# EAGLE design PaintDuino (EAGLE 6.2)
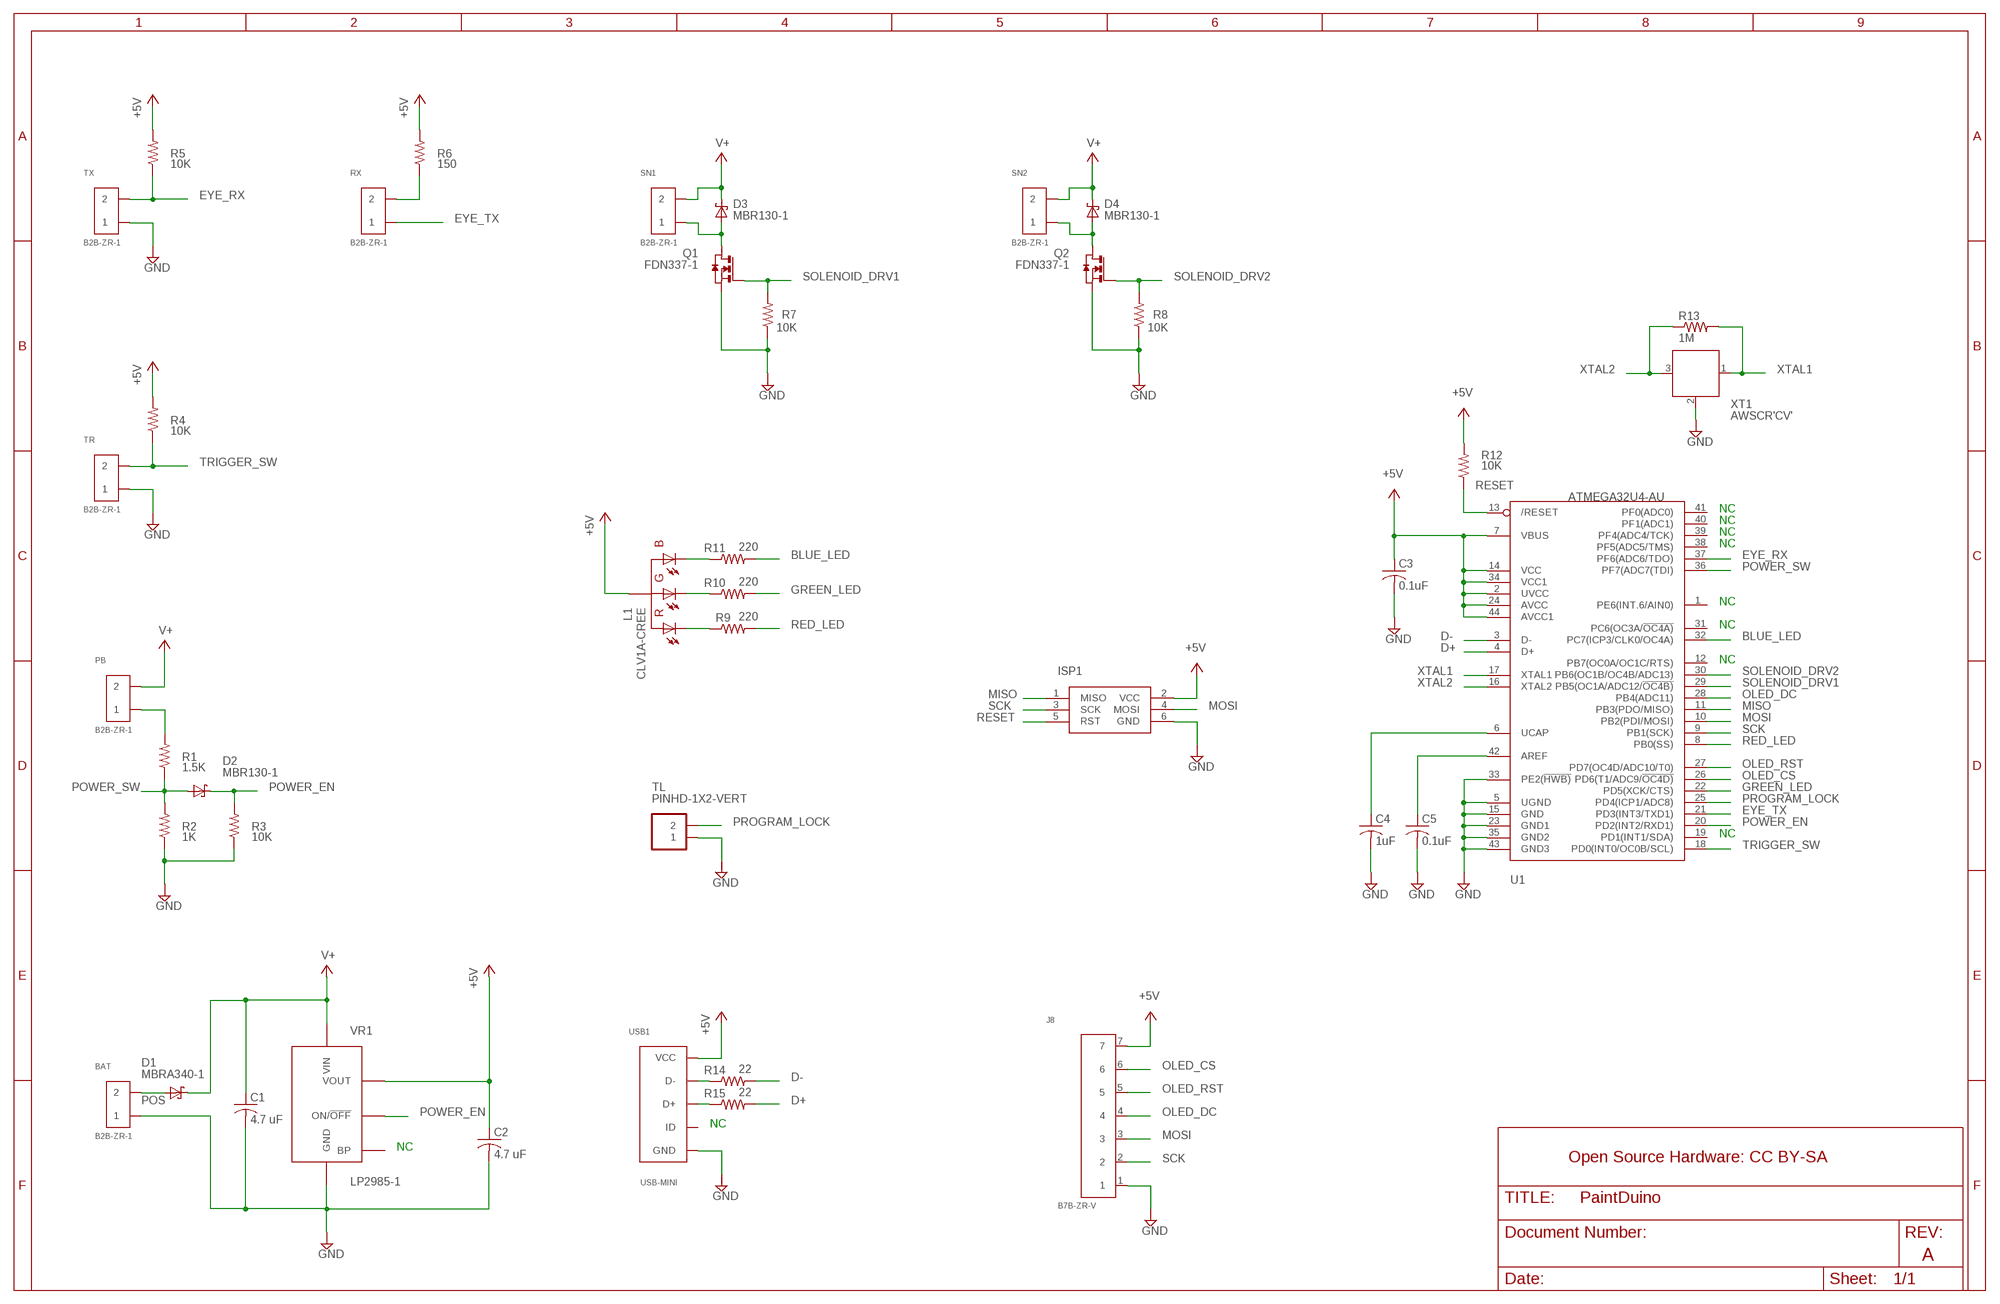
[diagram p0: schematic, sheet 1]

## Parts
BAT  B2B-ZR-1  [B2B-ZR]
C1  4.7 uF  CAP-0805  [C0805]
C2  4.7 uF  CAP-0805  [C0805]
C3  0.1uF  CAP-0805  [C0805]
C4  1uF  CAP-0805  [C0805]
C5  0.1uF  CAP-0805  [C0805]
D1  MBRA340-1  [DO214AC]
D2  MBR130-1  [SOD123]
D3  MBR130-1  [SOD123]
D4  MBR130-1  [SOD123]
ISP1  AVRISP-6  [AVRISP]
J8  B7B-ZR-V  [B7B-ZR]
L1  CLV1A-CREE  [PLCC4]
PB  B2B-ZR-1  [B2B-ZR]
Q1  FDN337-1  FDN359-1  [SOT23]
Q2  FDN337-1  FDN359-1  [SOT23]
R1  1.5K  RES-2  [R0805]
R2  1K  RES-2  [R0805]
R3  10K  RES-2  [R0805]
R4  10K  RES-2  [R0805]
R5  10K  RES-2  [R0805]
R6  150  RES-2  [R0805]
R7  10K  RES-2  [R0805]
R8  10K  RES-2  [R0805]
R9  220  RES-2  [R0805]
R10  220  RES-2  [R0805]
R11  220  RES-2  [R0805]
R12  10K  RES-2  [R0805]
R13  1M  RES-2  [R0805]
R14  22  RES-2  [R0805]
R15  22  RES-2  [R0805]
RX  B2B-ZR-1  [B2B-ZR]
SN1  B2B-ZR-1  [B2B-ZR]
SN2  B2B-ZR-1  [B2B-ZR]
TL  PINHD-1X2-VERT  [1X02]
TR  B2B-ZR-1  [B2B-ZR]
TX  B2B-ZR-1  [B2B-ZR]
U1  ATMEGA32U4-AU  [TQFP44]
USB1  USB-MINI  [USB-M2]
VR1  LP2985-1  [SOT23-5]
XT1  AWSCR'CV'  [AWSCR-CV]

## Nets
+5V: C2.1 C3.1 ISP1.2(VCC) J8.7 L1.2-CA(A) R4.2 R5.2 R6.2 R12.2 U1.2(UVCC) U1.7(VBUS) U1.14(VCC) U1.24(AVCC) U1.34(VCC1) U1.44(AVCC1) USB1.1(VCC) VR1.5(VOUT)
AREF: C5.1 U1.42(AREF)
BC: L1.3-B(BC) R11.1
BLUE_LED: R11.2 U1.32(PC7(ICP3/CLK0/OC4A))
D+: R15.2 U1.4(D+)
D-: R14.2 U1.3(D-)
EYE_C: R6.1 RX.2
EYE_RX: R5.1 TX.2 U1.37(PF6(ADC6/TDO))
EYE_TX: RX.1 U1.21(PD3(INT3/TXD1))
GC: L1.4-G(GC) R10.1
GND: BAT.1 C1.2 C2.2 C3.2 C4.2 C5.2 ISP1.6(GND) J8.1 Q1.2(S) Q2.2(S) R2.1 R3.1 R7.1 R8.1 TL.1 TR.1 TX.1 U1.5(UGND) U1.15(GND) U1.23(GND1) U1.33(PE2(!HWB)) U1.35(GND2) U1.43(GND3) USB1.5(GND) VR1.2(GND) XT1.2
GREEN_LED: R10.2 U1.22(PD5(XCK/CTS))
MISO: ISP1.1(MISO) U1.11(PB3(PDO/MISO))
MOSI: ISP1.4(MOSI) J8.3 U1.10(PB2(PDI/MOSI))
N$1: R14.1 USB1.2(D-)
N$2: R15.1 USB1.3(D+)
OLED_CS: J8.6 U1.26(PD6(T1/ADC9/!OC4D))
OLED_DC: J8.4 U1.28(PB4(ADC11))
OLED_RST: J8.5 U1.27(PD7(OC4D/ADC10/T0))
PB: PB.1 R1.2
POS: BAT.2 D1.A
POWER_EN: D2.C R3.2 U1.20(PD2(INT2/RXD1)) VR1.3(ON/!OFF)
POWER_SW: D2.A R1.1 R2.2 U1.36(PF7(ADC7(TDI))
PROGRAM_LOCK: TL.2 U1.25(PD4(ICP1/ADC8))
Q1_D: D3.A Q1.3(D) SN1.1
Q2_D: D4.A Q2.3(D) SN2.1
RC: L1.1-R(RC) R9.1
RED_LED: R9.2 U1.8(PB0(SS))
RESET: ISP1.5(RST) R12.1 U1.13(/RESET)
SCK: ISP1.3(SCK) J8.2 U1.9(PB1(SCK))
SOLENOID_DRV1: Q1.1(G) R7.2 U1.29(PB5(OC1A/ADC12/!OC4B))
SOLENOID_DRV2: Q2.1(G) R8.2 U1.30(PB6(OC1B/OC4B/ADC13))
TRIGGER_SW: R4.1 TR.2 U1.18(PD0(INT0/OC0B/SCL))
UCAP: C4.1 U1.6(UCAP)
V+: C1.1 D1.C D3.C D4.C PB.2 SN1.2 SN2.2 VR1.1(VIN)
XTAL1: R13.2 U1.17(XTAL1) XT1.1
XTAL2: R13.1 U1.16(XTAL2) XT1.3
Unconnected: U1.1(PE6(INT.6/AIN0)) U1.12(PB7(OC0A/OC1C/RTS)) U1.19(PD1(INT1/SDA)) U1.31(PC6(OC3A/!OC4A)) U1.38(PF5(ADC5/TMS)) U1.39(PF4(ADC4/TCK)) U1.40(PF1(ADC1)) U1.41(PF0(ADC0)) USB1.4(ID) VR1.4(BP)

## Notes on the sheet
- NC
- NC
- NC
- NC
- NC
- NC
- NC
- NC
- NC
- NC
- Open Source Hardware: CC BY-SA
- A

## Library data of the parts
BAT PB RX SN1 SN2 TR TX = Moorelogic:B2B-ZR
C1-C5 = Moorelogic:CAP
D1 = Moorelogic:MBRA340
D2-D4 = Moorelogic:MBR130
ISP1 = Moorelogic:AVRISP: AVR ISP HEADER Standard 6 pin header for AVR programming
J8 = Moorelogic:B7B-ZR
L1 = Moorelogic:CLV1A
Q1 Q2 = Moorelogic:FDN359
R1-R15 = Moorelogic:RES
TL = Moorelogic:PINHD-1X2
U1 = Moorelogic:ATMEGA32U4: http://www.ladyada.net/library/eagle
USB1 = Moorelogic:USB
VR1 = Moorelogic:LP2985
XT1 = Moorelogic:AWSCR: ceramic resonator with caps

## Net classes
0 default: width 0.381 mm, clearance 0.203 mm

## Board
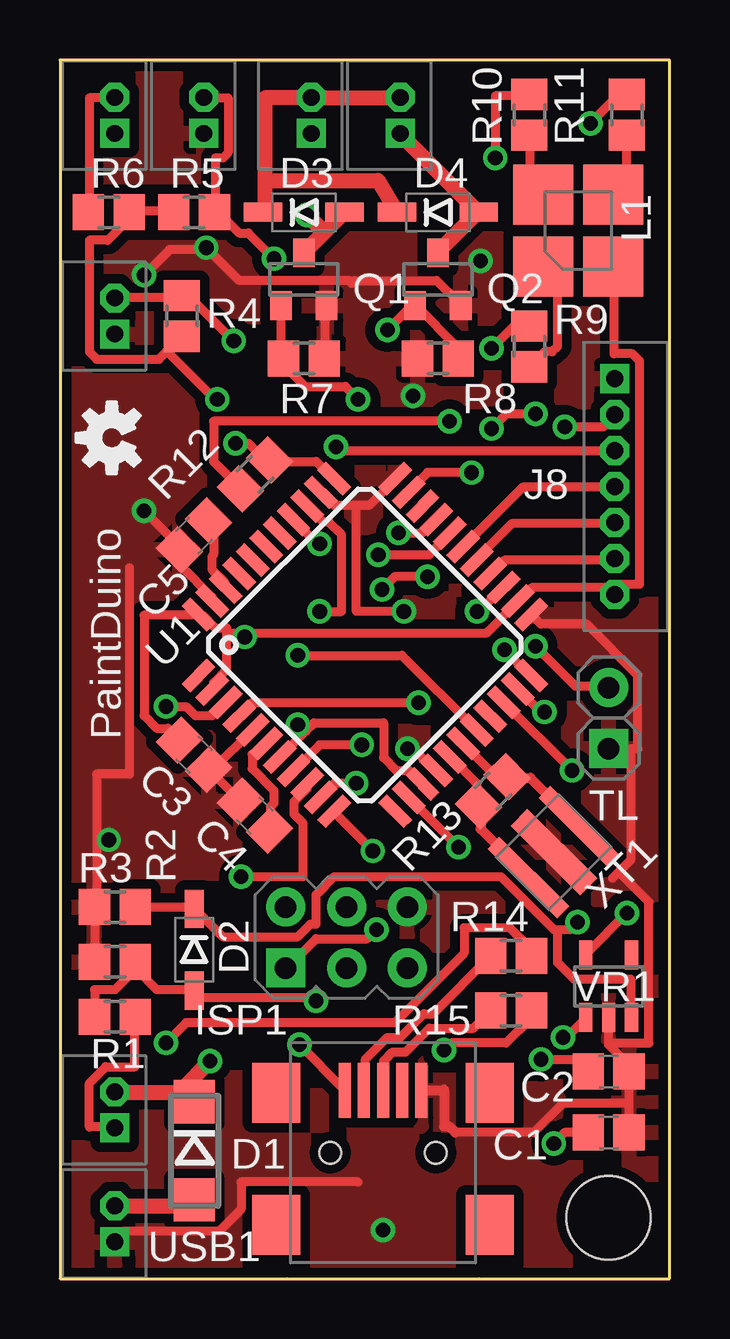
[diagram p1: board, top side]
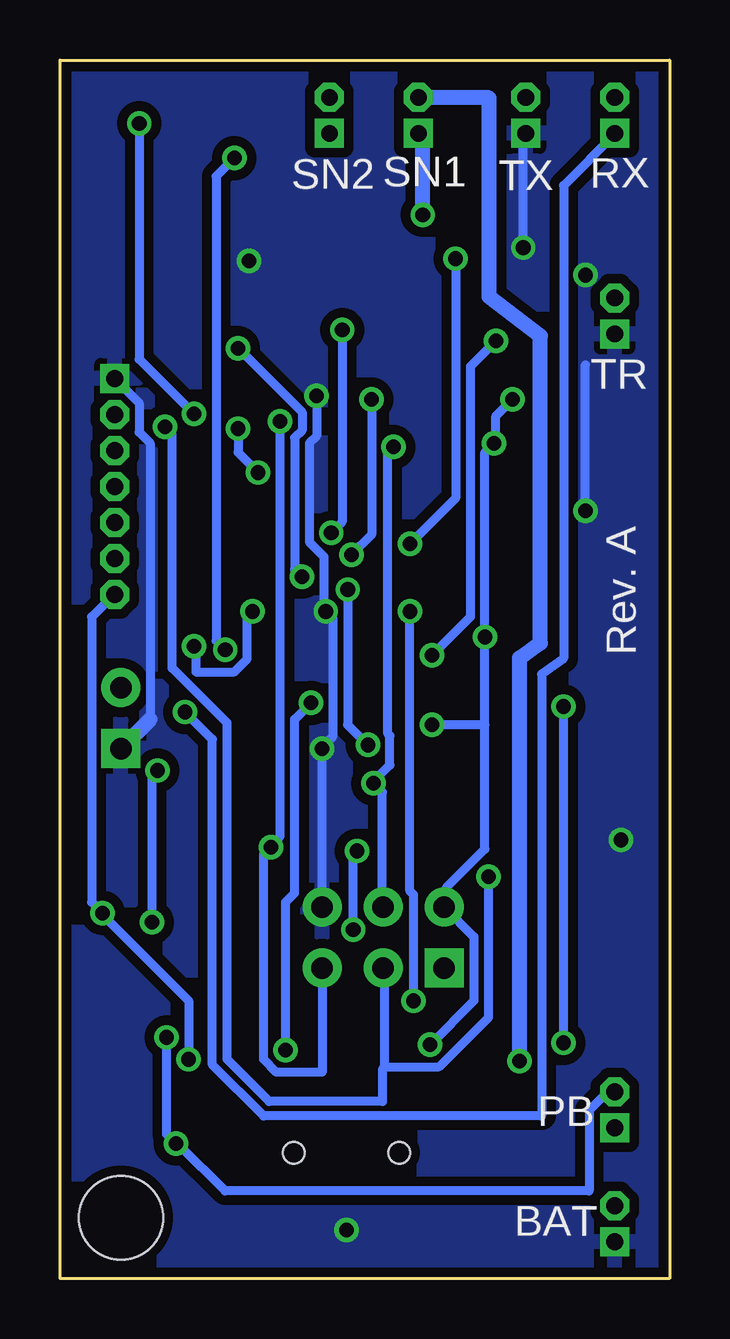
[diagram p2: board, bottom side, seen from below]

Size 25.4 x 50.8 mm. Coordinates in mm from the lower left corner, seen from the top.
Outline: 0,0 25.4,0 25.4,50.8 0,50.8 0,0
Copper layers (1*16): Top 0.035mm / dielectric 1.5mm / Bottom 0.035mm
Design rules: minimum track width 10mil, minimum drill 24mil, track to track 8mil, track to pad 8mil, pad to pad 8mil, via to via 8mil, smd to smd 8mil, copper to edge 15mil, drill to drill 8mil, minimum pad ring 10mil, minimum via ring 8mil, stop-mask expansion 4mil, vias tented up to drill 0mil, thermal gap 10mil
Holes 3.5 mm at 22.86,2.54

### Footprints (pad centres in the part's own frame; a part is rotated, then mirrored left to right if it is on the bottom)
B2B-ZR = drill 0.7 square: 1 -0.75,0 | drill 0.7 octagon: 2 0.75,0
C0805 = smd 1.3 x 1.5: 1 -0.85,0; 2 0.85,0
DO214AC = smd 1.8 x 1.7: A 2.05,0; C -2.05,0
SOD123 = smd 1.6 x 0.8: A 1.7,0; C -1.7,0
AVRISP = drill 0.9 pad 1.626 square: 1 -1.27,2.54 | drill 0.9 pad 1.626: 2 1.27,2.54; 3 -1.27,0; 4 1.27,0; 5 -1.27,-2.54; 6 1.27,-2.54
B7B-ZR = drill 0.7 square: 1 -4.5,0 | drill 0.7 octagon: 2 -3,0; 3 -1.5,0; 4 0,0; 5 1.5,0; 6 3,0; 7 4.5,0
PLCC4 = smd 2.5 x 2.5: 1-R -1.455,-1.5; 2-CA 1.455,-1.5; 3-B 1.455,1.5; 4-G -1.455,1.5
SOT23 = smd 0.9 x 1.2: 1 -0.95,-1.1; 2 0.95,-1.1; 3 0,1.1
R0805 = smd 1.3 x 1.5: 1 -0.85,0; 2 0.85,0
1X02 = drill 0.9 pad 1.626 square: 1 -1.27,0 | drill 0.9 pad 1.626: 2 1.27,0
TQFP44 = smd 1.5 x 0.5: 1 -5.8,4; 2 -5.8,3.2; 3 -5.8,2.4; 4 -5.8,1.6; 5 -5.8,0.8; 6 -5.8,0; 7 -5.8,-0.8; 8 -5.8,-1.6; 9 -5.8,-2.4; 10 -5.8,-3.2; 11 -5.8,-4; 23 5.8,-4; 24 5.8,-3.2; 25 5.8,-2.4; 26 5.8,-1.6; 27 5.8,-0.8; 28 5.8,0; 29 5.8,0.8; 30 5.8,1.6; 31 5.8,2.4; 32 5.8,3.2; 33 5.8,4 | smd 0.5 x 1.5: 12 -4,-5.8; 13 -3.2,-5.8; 14 -2.4,-5.8; 15 -1.6,-5.8; 16 -0.8,-5.8; 17 0,-5.8; 18 0.8,-5.8; 19 1.6,-5.8; 20 2.4,-5.8; 21 3.2,-5.8; 22 4,-5.8; 34 4,5.8; 35 3.2,5.8; 36 2.4,5.8; 37 1.6,5.8; 38 0.8,5.8; 39 0,5.8; 40 -0.8,5.8; 41 -1.6,5.8; 42 -2.4,5.8; 43 -3.2,5.8; 44 -4,5.8
USB-M2 = smd 0.5 x 2.3: 1 -1.6,2.6; 2 -0.8,2.6; 3 0,2.6; 4 0.8,2.6; 5 1.6,2.6 | smd 2 x 2.5: TAB1 -4.45,2.5; TAB2 -4.45,-3; TAB3 4.45,2.5; TAB4 4.45,-3 | hole 0.9: -2.2,0; 2.2,0
SOT23-5 = smd 0.55 x 1.2: 1 -0.95,-1.3; 2 0,-1.3; 3 0.95,-1.3; 4 0.95,1.3; 5 -0.95,1.3
AWSCR-CV = smd 0.7 x 4.1: 1 -1.5,0; 3 1.5,0 | smd 1 x 4.1: 2 0,0

### Placement (x,y rotation side)
BAT  2.29,2.29 90 top
C1  22.86,6.1 0 top
C2  22.86,8.64 0 top
C3  5.59,21.84 315 top
C4  8.13,19.3 135 top
C5  5.59,30.99 225 top
D1  5.59,5.33 270 top
D2  5.59,13.72 270 top
D3  10.16,44.45 0 top
D4  15.75,44.45 0 top
ISP1  11.94,14.22 90 top
J8  23.11,33.02 270 top
L1  21.59,43.69 0 top
PB  2.29,7.04 90 top
Q1  10.16,41.66 0 top
Q2  15.75,41.66 0 top
R1  2.29,10.92 0 top
R2  2.29,13.21 0 top
R3  2.29,15.49 0 top
R4  5.08,40.13 270 top
R5  5.59,44.45 180 top
R6  2.03,44.45 0 top
R7  10.16,38.35 180 top
R8  15.75,38.35 0 top
R9  19.56,38.86 90 top
R10  19.56,48.51 90 top
R11  23.62,48.51 90 top
R12  8.13,33.53 45 top
R13  18.03,20.32 45 top
R14  18.8,13.46 0 top
R15  18.8,11.18 0 top
RX  2.29,48.49 90 top
SN1  10.46,48.49 90 top
SN2  14.17,48.49 90 top
TL  22.86,23.37 90 top
TR  2.29,40.13 90 top
TX  5.99,48.49 90 top
U1  12.7,26.42 45 top
U$1  [OSHW-LOGO-S]  2.16,35.05 90 top
USB1  13.46,5.26 0 top
VR1  22.86,12.19 0 top
XT1  20.57,17.78 225 top

### Tracks (layer width: path | path; a pad name or v marks a point on that pad's centre or on a via)
+5V  (via drill 0.61)
  Top 0.381: R5.2 4.72,44.5 2.9,44.5 R6.2 3.05,44.35 1.98,43.28 1.22,43.28 1.22,38.63 1.52,38.33 4.12,38.33 4.46,38.67 | 4.46,38.67 5.03,39.24 R4.2 | 10.25,22.82 9.22,21.79 U1.7 | 10.25,22.82 10.59,23.16 13.49,23.16 13.49,21.72 14.02,21.18 14.55,21.18 15.09,20.65 U1.14 | U1.34 11.35,33.38 10.67,34.06 8.76,34.06 R12.2 8.53,34.14 7.85,34.82 v7.32,34.82 | v9.98,9.75 11.81,7.92 USB1.1 | 10.25,22.82 9.98,23.09 v9.91,23.09 | 4.46,38.67 6.48,36.65 v6.55,36.65 | C3.1 4.95,22.48 4.5,22.94 4.04,22.94 3.5,23.47 3.5,27.66 5.71,27.66 U1.44 5.94,27.66 6.48,27.13 6.93,27.13 6.93,26.9 | 6.93,26.9 6.93,25.38 6.4,24.84 6.4,24.61 U1.2 | v23.62,15.24 21.95,13.56 VR1.5 | v20.04,9.14 21.49,9.14 21.95,8.69 C2.1 | L1.2-CA 23.09,42.14 23.09,38.56 23.85,38.56 24.16,38.25 24.16,28.96 22.94,28.96 J8.7 23.09,28.57 22.86,28.8 19.66,28.8 19.13,28.27 U1.24 18.97,28.12 17.75,26.9 7.7,26.9 | 7.7,26.9 6.93,26.9 | v7.7,26.75 7.7,26.9
  Bottom 0.381: v9.98,9.75 8.15,11.58 8.15,14.25 ISP1.2 9.3,15.62 9.3,16.31 7.7,17.91 7.7,23.09 | 7.7,23.09 v7.7,26.75 7.7,34.44 v7.32,34.82 7.24,34.98 7.24,35.97 v6.55,36.65 | 7.7,23.09 v9.91,23.09 | J8.7 23.16,28.5 24.08,27.58 24.08,15.7 v23.62,15.24 23.55,15.09 20.04,11.58 v20.04,9.14
AREF
  Top 0.381: U1.42 6.86,28.88 6.86,29.03 6.33,29.57 6.33,30.1 6.4,30.18 6.4,31.55 6.25,31.55 C5.1
BC
  Top 0.381: R11.1 23.62,45.26 23.09,45.26 L1.3-B
BLUE_LED  (via drill 0.61)
  Top 0.381: v17.14,33.6 15.32,33.6 14.55,32.84 U1.32 | v17.98,35.43 18.59,36.04 v19.81,36.04 | v22.1,48.16 23.24,49.3 23.62,49.3 R11.2
  Bottom 0.381: v17.14,33.6 17.98,34.44 v17.98,35.43 | v19.81,36.04 22.1,38.33 v22.1,48.16
D+  (via drill 0.61)
  Top 0.381: v14.94,24 8,24 7.47,23.47 U1.4 | v16,9.53 16.31,9.83 18.59,9.83 19.58,10.82 19.58,11.12 R15.2
  Bottom 0.381: v14.94,24 15.62,23.32 15.62,16.08 16,15.7 v16,9.53
D-  (via drill 0.61)
  Top 0.381: v4.42,23.85 5.26,23.85 5.64,23.47 6.33,23.47 6.86,24 U1.3 | v4.42,9.83 5.26,10.67 13.95,10.67 16.84,13.56 16.84,14.63 18.75,14.63 19.58,13.79 19.58,13.49 R14.2
  Bottom 0.381: v4.42,9.83 v4.42,23.85
EYE_C
  Top 0.381: R6.1 1.22,44.5 1.22,49.23 2.29,49.23 RX.2
EYE_RX  (via drill 0.61)
  Top 0.381: TX.2 6.02,49.23 7.01,49.23 7.01,46.94 6.78,46.71 6.48,46.71 6.48,44.5 R5.1 6.63,44.42 7.47,43.59 7.85,43.59 v8.91,42.52 | v10.82,30.63 10.74,30.63 9.75,31.62 U1.37
  Bottom 0.381: v10.82,30.63 8.91,32.54 v8.91,42.52
EYE_TX  (via drill 0.61)
  Top 0.381: v20.19,23.62 20.04,23.62 19.13,24.54 U1.21
  Bottom 0.381: v20.19,23.62 19.05,22.48 19.05,8.91 16.92,6.78 5.33,6.78 5.33,25.2 4.42,25.86 4.42,45.57 2.29,47.7 RX.1
GC
  Top 0.381: R10.1 19.58,47.62 19.58,45.26 20.12,45.26 L1.4-G
GND  (via drill 0.61)
  Top 0.381: TL.1 23.77,22.1 | 23.77,22.1 24.08,22.1 24.08,25.15 21.95,27.28 20.04,27.28 19.66,27.66 U1.23 | 21.64,16.69 20.57,17.75 XT1.2 | 23.28,16.95 23.77,17.45 23.77,22.1 | 23.28,16.95 23.01,16.69 | 22.86,9.83 22.86,9.75 23.7,8.91 23.7,8.69 C2.2 23.7,8.46 23.7,7.32 | 22.86,9.83 VR1.2 | 23.7,7.32 23.7,6.1 C1.2 | 16.46,6.1 19.74,6.1 20.95,7.32 23.7,7.32 | 15.09,7.85 USB1.5 | 12.42,4.04 7.54,4.04 7.54,2.9 6.63,1.98 2.67,1.98 2.29,1.6 BAT.1 | 23.28,16.95 24.54,15.7 24.54,9.83 22.86,9.83 | R2.1 1.45,13.26 1.45,15.47 R3.1 1.52,15.62 1.52,21.03 2.9,21.03 2.9,29.64 | C3.2 6.25,21.18 7.47,19.96 C4.2 | U1.5 8,22.86 6.4,21.26 C3.2 | 6.17,21.03 C3.2 | U1.43 6.33,28.27 6.33,28.42 5.03,29.72 5.03,30.33 C5.2 4.95,30.56 v3.5,32 | 12.34,32.23 12.88,32.23 13.95,33.3 U1.33 | 12.34,32.23 11.43,32.23 10.9,32.77 U1.35 | v14.48,22.1 14.71,22.1 15.62,21.18 U1.15 | 12.34,32.23 12.34,27.81 v14.33,27.81 | Q2.2 16.69,40.62 15.7,41.6 12.27,41.6 12.15,41.49 12.04,41.6 7.47,41.6 v6.1,42.98 5.94,42.9 4.57,42.9 v3.5,41.83 | 11.28,40.62 Q1.2 11.05,40.54 11.05,38.41 R7.1 11.2,38.41 | 14.86,38.41 R8.1 | 23.09,37.49 J8.1
  Top 0.406: 15.09,7.85 16,7.85 | 16,7.85 16,7.87 | 16,7.85 16,6.35 16.2,6.35 16.46,6.1
  Bottom 0.381: v3.5,32 3.5,38.1 | 2.29,39.32 TR.1 2.44,39.47 | ISP1.6 v14.48,22.1 14.4,22.25 14.02,22.63 14.02,27.51 v14.33,27.81 14.4,27.96 14.4,30.1 15.01,30.71 15.01,34.82 14.71,35.13 v14.71,36.8 | 6.02,47.7 6.1,47.62 v6.1,42.98 | 21.64,23.32 21.64,34.82 22.1,35.28 22.1,36.5 23.09,37.49 J8.1
  Bottom 0.635: 21.64,23.32 TL.1
  other vias: 2.03,18.29 13.46,2.03 17.53,42.42
  pour Bottom (isolate 0.406): -1.27,52.07 26.67,52.07 26.67,-1.27 -1.27,-1.27
  pour Top (isolate 0.406): -1.27,52.2 26.67,52.2 26.67,-1.27 -1.27,-1.27
GREEN_LED  (via drill 0.61)
  Top 0.381: v18.52,26.21 19.58,25.15 U1.22 | v18.14,46.71 18.14,49.3 19.51,49.3 R10.2
  Bottom 0.381: v18.52,26.21 18.9,26.59 18.9,45.95 v18.14,46.71
MISO  (via drill 0.61)
  Top 0.381: v13.03,17.83 11.43,19.43 U1.11 | v13.18,14.55 12.8,14.17 10.67,14.17 9.45,12.95 ISP1.1
  Bottom 0.381: v13.03,17.83 13.18,17.68 v13.18,14.55
MOSI  (via drill 0.61)
  Top 0.381: v12.34,20.65 11.43,20.65 10.9,20.12 U1.10 | v11.51,34.67 11.66,34.52 23.09,34.52 J8.3
  Bottom 0.381: ISP1.4 11.96,15.54 11.96,20.27 v12.34,20.65 12.27,20.8 11.66,21.41 11.66,22.63 11.73,22.71 11.73,34.44 v11.51,34.67
N$1
  Top 0.381: R14.1 17.91,13.41 15.54,11.05 15.16,11.05 14.17,10.06 13.64,10.06 12.72,9.14 12.72,7.92 USB1.2
N$2
  Top 0.381: R15.1 17.91,11.12 17.22,10.44 15.39,10.44 14.4,9.45 13.87,9.45 13.49,9.07 13.49,7.92 USB1.3
OLED_CS
  Top 0.381: U1.26 17.98,29.41 18.52,29.95 23.09,29.95 J8.6
OLED_DC
  Top 0.381: U1.28 19.28,32.99 23.09,32.99 J8.4
OLED_RST
  Top 0.381: U1.27 17.37,30.02 18.82,31.47 23.09,31.47 J8.5
PB
  Top 0.381: R1.2 3.12,10.9 3.12,8.84 1.91,8.84 1.22,8.15 1.22,6.33 2.29,6.33 PB.1
POS
  Top 0.381: 5.33,3.05 5.56,3.28 D1.A | BAT.2
  Top 0.635: BAT.2 5.33,3.05
POWER_EN  (via drill 0.61)
  Top 0.381: 20.73,14.55 20.73,13.18 21.41,12.5 23.77,12.5 23.77,10.9 VR1.3 | 20.73,14.55 20.57,14.55 18.36,16.76 11.43,16.76 10.67,16 10.67,14.78 10.44,14.78 9.91,14.25 6.78,14.25 5.64,15.39 D2.C 5.41,15.47 3.2,15.47 R3.2 | v21.34,21.18 18.52,24 U1.20 | v21.57,14.86 21.26,14.55 20.73,14.55
  Bottom 0.381: v21.34,21.18 21.57,20.95 v21.57,14.86
POWER_SW  (via drill 0.61)
  Top 0.381: R1.1 1.45,10.97 1.45,12.04 2.29,12.04 3.12,12.88 3.12,13.18 R2.2 3.28,12.8 4.04,12.04 5.41,12.04 D2.A 5.64,11.96 5.87,11.73 10.52,11.73 v10.67,11.58 | v10.82,27.81 11.73,27.81 11.73,31.01 11.2,31.55 10.97,31.55 10.36,32.16 U1.36
  Bottom 0.381: v10.82,27.81 10.82,16.15 10.67,16 v10.67,11.58
PROGRAM_LOCK  (via drill 0.61)
  Top 0.381: v17.37,27.81 17.45,27.81 18.44,28.8 U1.25 | v19.81,26.36 21.49,24.69 22.86,24.69 TL.2
  Bottom 0.381: v17.37,27.81 17.6,27.58 17.6,25.83 18.14,25.3 19.74,25.3 19.74,26.29 v19.81,26.36
Q1_D  (via drill 0.61)
  Top 0.381: 10.21,42.82 Q1.3 | 11.81,44.42 D3.A
  Top 0.635: 11.81,44.42 11.01,43.62 | 11.01,43.62 10.21,42.82 | 11.01,43.62 v10.29,44.35
  Bottom 0.635: v10.29,44.35 10.29,47.55 10.44,47.7 SN1.1
Q2_D
  Top 0.381: 15.77,42.82 Q2.3 | 17.37,44.42 D4.A 17.3,44.58 | 14.17,47.7 SN2.1
  Top 0.635: 17.37,44.42 15.77,42.82 | 17.3,44.58 14.17,47.7
RC
  Top 0.381: R9.1 19.58,38.02 20.19,38.63 20.5,38.63 20.73,38.86 20.73,42.14 20.19,42.14 L1.1-R
RED_LED  (via drill 0.61)
  Top 0.381: v12.57,22.25 10.82,22.25 9.75,21.18 U1.8 | v13.41,28.73 13.95,29.26 v15.32,29.26 | v17.98,38.79 18.9,39.7 19.51,39.7 R9.2
  Bottom 0.381: v12.57,22.25 13.41,23.09 v13.41,28.73 | v15.32,29.26 15.62,29.57 15.62,35.05 15.32,35.36 15.32,36.12 v17.98,38.79
RESET  (via drill 0.61)
  Top 0.381: v16.61,17.98 14.55,20.04 U1.13 | v16.23,35.74 6.4,35.74 6.4,34.06 7.47,32.99 R12.1
  Bottom 0.381: ISP1.5 14.48,8.61 16.38,8.61 16.92,9.14 16.92,17.68 v16.61,17.98 16.54,18.14 16.23,18.44 v16.23,35.74
SCK  (via drill 0.61)
  Top 0.381: v7.54,16.76 10.13,16.76 10.13,18.97 9.75,19.36 9.75,19.89 10.29,20.42 10.29,20.57 U1.9 | v21.03,35.51 22.63,35.51 23.09,35.97 J8.2
  Bottom 0.381: v7.54,16.76 7.54,10.9 9.6,8.84 11.89,8.84 | 11.89,8.84 11.89,12.95 ISP1.3 | v21.03,35.51 20.73,35.2 20.73,25.45 18.44,23.16 18.44,9.14 16.69,7.39 11.96,7.39 11.96,8.69 11.89,8.84
SOLENOID_DRV1  (via drill 0.61)
  Top 0.381: Q1.1 9.22,40.54 9.22,38.41 9.3,38.41 R7.2 9.14,38.25 10.21,37.19 11.89,37.19 v12.42,36.65 | v13.26,30.18 15.39,30.18 16.23,31.01 U1.29
  Bottom 0.381: v13.26,30.18 12.42,31.01 v12.42,36.65
SOLENOID_DRV2  (via drill 0.61)
  Top 0.381: R8.2 16.54,38.41 16.54,38.86 14.86,40.54 Q2.1 14.63,40.54 v13.64,39.55 | v14.1,31.09 15.09,31.09 15.62,31.62 U1.30
  Bottom 0.381: v14.1,31.09 13.64,31.55 v13.64,39.55
TRIGGER_SW  (via drill 0.61)
  Top 0.381: TR.2 2.29,40.92 5.03,40.92 R4.1 5.26,40.92 5.41,40.92 v7.24,39.09 | v9.91,25.98 14.25,25.98 17.3,22.94 U1.18
  Bottom 0.381: v9.91,25.98 8.31,27.58 8.31,38.02 v7.24,39.09
UCAP
  Top 0.381: U1.6 8.15,21.87 8,21.87 8,21.26 8.91,20.34 8.91,19.81 8.76,19.66 8.76,18.75 C4.1
V+  (via drill 0.61)
  Top 0.381: 8.53,44.5 D3.C | 10.44,49.23 SN1.2 10.59,49.23 | 14.02,44.5 D4.C | 14.17,49.23 SN2.2 | v20.95,10.06 21.11,10.06 21.87,10.82 VR1.1 | v20.57,5.64 21.03,6.1 C1.1 | 5.18,7.77 5.56,7.39 D1.C 5.11,7.92 | 2.29,7.77 PB.2
  Top 0.635: 8.53,45.77 8.53,49.23 10.44,49.23 | 8.53,45.77 8.53,44.5 | 14.02,44.5 13.26,45.77 8.53,45.77 | 10.59,49.23 14.17,49.23 | 2.29,7.77 5.18,7.77 | 5.11,7.92 v6.25,9.07
  Bottom 0.381: v20.95,10.06 20.95,6.02 v20.57,5.64 20.42,5.56 18.52,3.66 3.35,3.66 3.35,7.01 2.59,7.77 2.29,7.77 PB.2 | 10.44,49.23 SN1.2
  Bottom 0.635: 10.44,49.23 7.52,49.23 7.52,40.92 5.38,39.29 5.38,26.49 6.25,25.88 v6.25,9.07
XTAL1
  Top 0.381: U1.17 16.84,22.25 18.14,20.95 18.59,20.95 R13.2 18.82,20.88 | 21.57,18.9 XT1.1
  Top 0.406: 18.82,20.88 19.6,20.88 XT1.1
XTAL2
  Top 0.381: U1.16 16.31,21.72 17.37,20.65 17.37,19.74 R13.1 17.53,19.58 | 18.75,17.53 19.51,16.76 XT1.3
  Top 0.406: 17.53,19.58 17.53,18.75 18.75,17.53

### Text on the board
tPlace: PaintDuino
bPlace: Rev. A